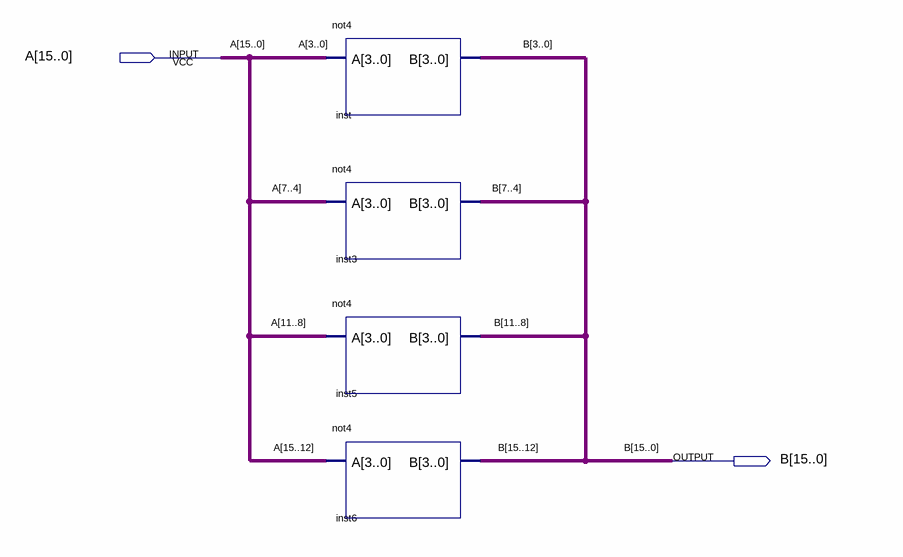
[diagram p0: schematic sheet]
// Quartus schematic not16.bdf as structural Verilog: 4 symbols, 2 pins
module not16 (
  input  [15:0] A,
  output [15:0] B
);

  not4 inst (.A(A[3:0]), .B(B[3:0]));
  not4 inst3 (.A(A[7:4]), .B(B[7:4]));
  not4 inst5 (.A(A[11:8]), .B(B[11:8]));
  not4 inst6 (.A(A[15:12]), .B(B[15:12]));
endmodule
